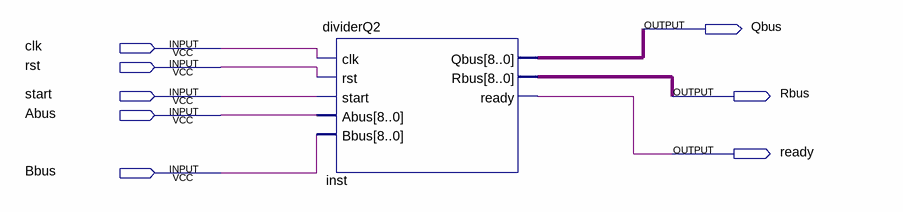
[diagram p0: schematic sheet]
// Quartus schematic Block.bdf as structural Verilog: 1 symbols, 8 pins
module Block (
  input  clk,
  input  rst,
  input  start,
  input  Abus,
  input  Bbus,
  output Qbus,
  output Rbus,
  output ready
);

  wire [8:0] inst_qbus, inst_rbus;

  dividerQ2 inst (
    .clk(clk), .rst(rst), .start(start), .Abus({9{Abus}}), .Bbus({9{Bbus}}), .Qbus(inst_qbus),
    .Rbus(inst_rbus), .ready(ready));
endmodule
